# EAGLE design payload (EAGLE 9.6.2)
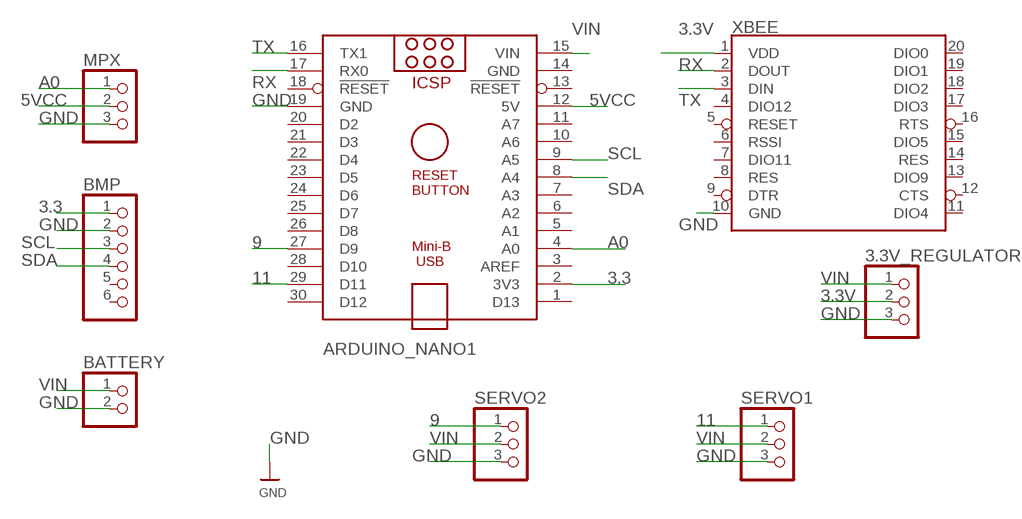
[diagram p0: schematic, sheet 1]

## Parts
3.3V_REGULATOR  PINHD-1X3  [1X03]
ARDUINO_NANO1  ARDUINO_NANO  [ARDUINO_NANO]
BATTERY  PINHD-1X2  [1X02]
BMP  PINHD-1X6  [1X06]
MPX  PINHD-1X3  [1X03]
SERVO1  PINHD-1X3  [1X03]
SERVO2  PINHD-1X3  [1X03]
XBEE  XBEE  [XBEE]

## Nets
3.3: ARDUINO_NANO1.2(3V3) BMP.1
3.3V: 3.3V_REGULATOR.2 XBEE.1(VDD)
5VCC: ARDUINO_NANO1.12(5V) MPX.2
9: ARDUINO_NANO1.27(D9) SERVO2.1
11: ARDUINO_NANO1.29(D11) SERVO1.1
A0: ARDUINO_NANO1.4(A0) MPX.1
GND: 3.3V_REGULATOR.3 ARDUINO_NANO1.19(GND) BATTERY.2 BMP.2 MPX.3 SERVO1.3 SERVO2.3 XBEE.10(GND)
RX: ARDUINO_NANO1.17(RX0) XBEE.2(DOUT)
SCL: ARDUINO_NANO1.9(A5) BMP.3
SDA: ARDUINO_NANO1.8(A4) BMP.4
TX: ARDUINO_NANO1.16(TX1) XBEE.3(DIN)
VIN: 3.3V_REGULATOR.1 ARDUINO_NANO1.15(VIN) BATTERY.1 SERVO1.2 SERVO2.2
Unconnected: ARDUINO_NANO1.1(D13) ARDUINO_NANO1.3(AREF) ARDUINO_NANO1.5(A1) ARDUINO_NANO1.6(A2) ARDUINO_NANO1.7(A3) ARDUINO_NANO1.10(A6) ARDUINO_NANO1.11(A7) ARDUINO_NANO1.13(!RESET) ARDUINO_NANO1.18(!RESET) ARDUINO_NANO1.20(D2) ARDUINO_NANO1.21(D3) ARDUINO_NANO1.22(D4) ARDUINO_NANO1.23(D5) ARDUINO_NANO1.24(D6) ARDUINO_NANO1.25(D7) ARDUINO_NANO1.26(D8) ARDUINO_NANO1.28(D10) ARDUINO_NANO1.30(D12) BMP.5 BMP.6 XBEE.4(DIO12) XBEE.5(RESET) XBEE.6(RSSI) XBEE.7(DIO11) XBEE.8(RES) XBEE.9(DTR) XBEE.11(DIO4) XBEE.12(CTS) XBEE.13(DIO9) XBEE.14(RES) XBEE.15(DIO5) XBEE.16(RTS) XBEE.17(DIO3) XBEE.18(DIO2) XBEE.19(DIO1) XBEE.20(DIO0)

## Power pins joined to a net without a drawn wire
GND: ARDUINO_NANO1.14(GND)

## Library data of the parts
3.3V_REGULATOR MPX SERVO1 SERVO2 = Connector:PINHD-1X3: PIN HEADER; CATEGORY: CONNECTOR; SUB-CATEGORY: PIN-HEADER
ARDUINO_NANO1 = ArduinoNanoV30:ARDUINO_NANO: Arduino Nano V3.0 Overview: The Arduino Nano is a small, complete, and breadboard-friendly board based on the ATmega328 (Arduino Nano 3.x) or ATmega168 (Arduino Nano 2.x). It has more or less the same functionality of the Arduino Duemilanove, but in a different package. It lacks only a DC power jack, and works with a Mini-B USB cable instead of a standard one. The Nano was designed and is being produced by Gravitech. Specifications: Microcontroller Atmel ATmega168 or ATmega328 Operating Voltage (logic level) 5 V Input Voltage (recommended) 7-12 V Input Voltage (limits) 6-20 V Digital I/O Pins 14 (of which 6 provide PWM output) Analog Input Pins 8 DC Current per I/O Pin 40 mA Flash Memory 16 KB (ATmega168) or 32 KB (ATmega328) of which 2 KB used by bootloader SRAM 1 KB (ATmega168) or 2 KB (ATmega328) EEPROM 512 bytes (ATmega168) or 1 KB (ATmega328) Clock Speed 16 MHz Dimensions 0.73" x 1.70" Length 45 mm Width 18 mm Weigth 5 g Power: The Arduino Nano can be powered via the Mini-B USB connection, 6-20V unregulated external power supply (pin 30), or 5V regulated external power supply (pin 27). The power source is automatically selected to the highest voltage source. Memory: The ATmega168 has 16 KB of flash memory for storing code (of which 2 KB is used for the bootloader); the ATmega328 has 32 KB, (also with 2 KB used for the bootloader). The ATmega168 has 1 KB of SRAM and 512 bytes of EEPROM (which can be read and written with the EEPROM library); the ATmega328 has 2 KB of SRAM and 1 KB of EEPROM. Input and Output: Each of the 14 digital pins on the Nano can be used as an input or output, using pinMode(), digitalWrite(), and digitalRead() functions. They operate at 5 volts. Each pin can provide or receive a maximum of 40 mA and has an internal pull-up resistor (disconnected by default) of 20-50 kOhms. In addition, some pins have specialized functions. Visit Arduino - ArduinoBoardNano <https://www.arduino.cc/en/Main/ArduinoBoardNano>
BATTERY = Connector:PINHD-1X2: PIN HEADER; CATEGORY: CONNECTOR; SUB-CATEGORY: PIN-HEADER
BMP = Connector:PINHD-1X6: PIN HEADER; CATEGORY: CONNECTOR; SUB-CATEGORY: PIN-HEADER
XBEE = SparkFun-RF:XBEE: Digi XBee and XBee Pro XBees are tiny blue chips that can communicate wirelessly with each other. They can do simple things, like replacing a couple of wires in serial communication, which is nice when you want to make a remote for your paintball vehicle. SparkFun Products SparkFun XBee Buying Guide <https://www.sparkfun.com/pages/xbee_guide> SparkFun XBee Explorer USB <https://www.sparkfun.com/products/11812> (WRL-11812) Breakout Board for XBee Module <https://www.sparkfun.com/products/8276> (WRL-8276) SparkFun XBee Explorer Regulated <https://www.sparkfun.com/products/11373> (WRL-11373) SparkFun XBee Explorer Dongle <https://www.sparkfun.com/products/11697> (WRL-11697) SparkFun XBee Shield <https://www.sparkfun.com/products/12847> (WRL-12847) SparkFun XBee Explorer Serial <https://www.sparkfun.com/products/13225> (WRL-13225)

## Board
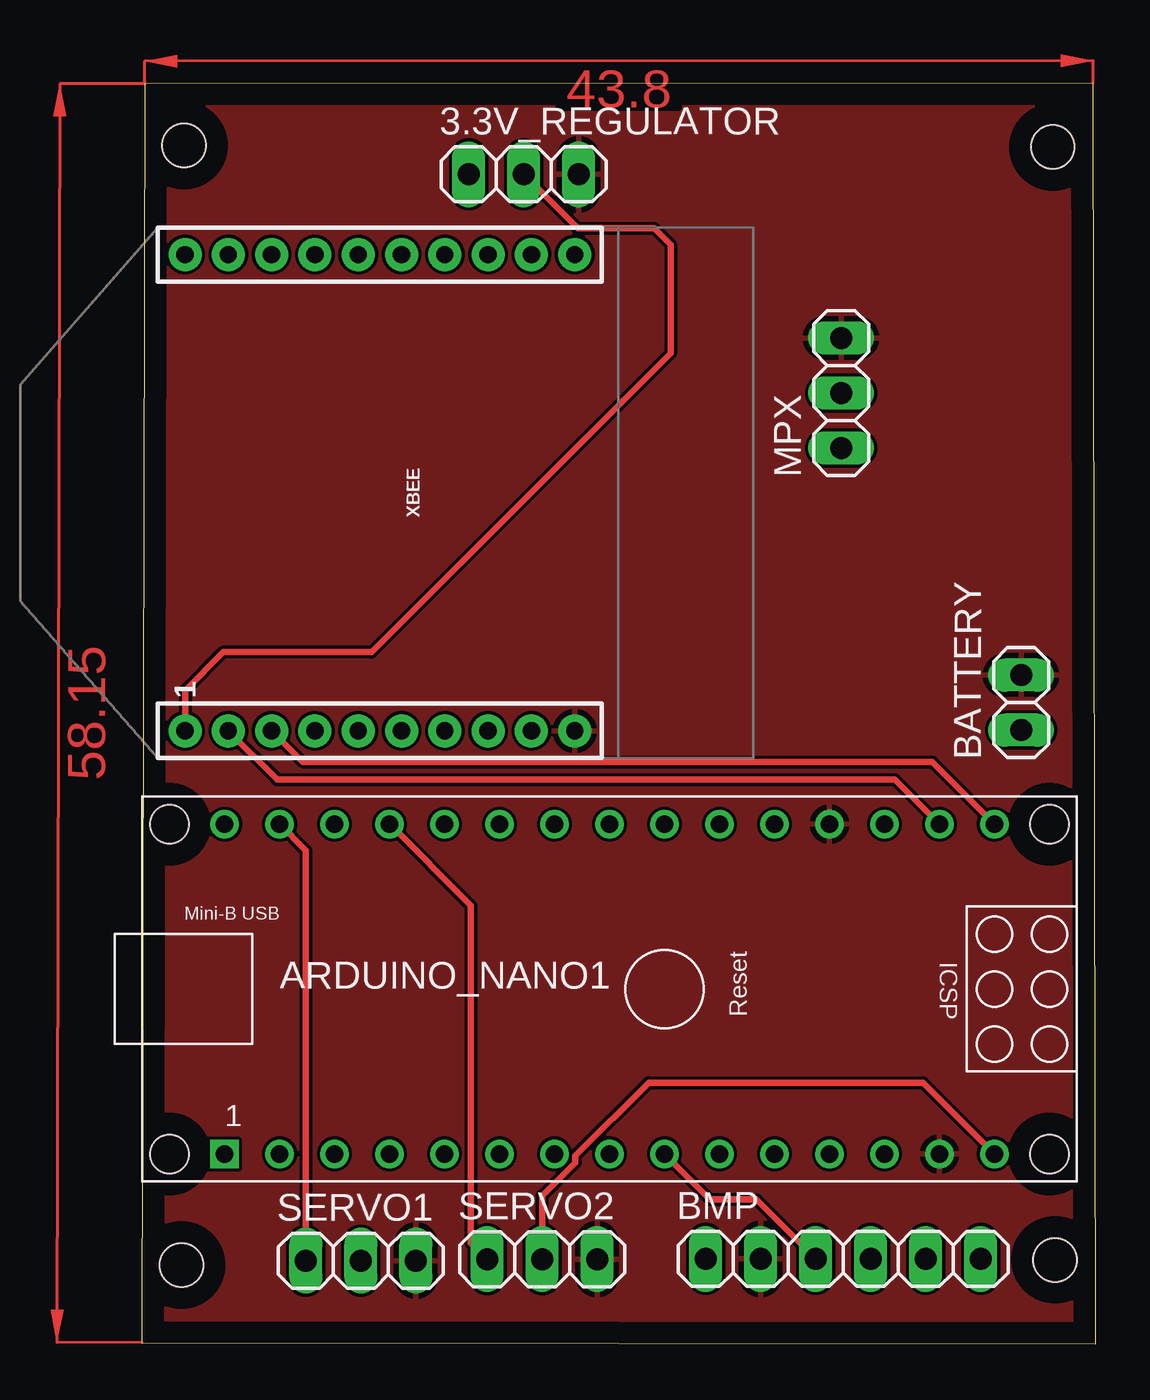
[diagram p1: board, top side]
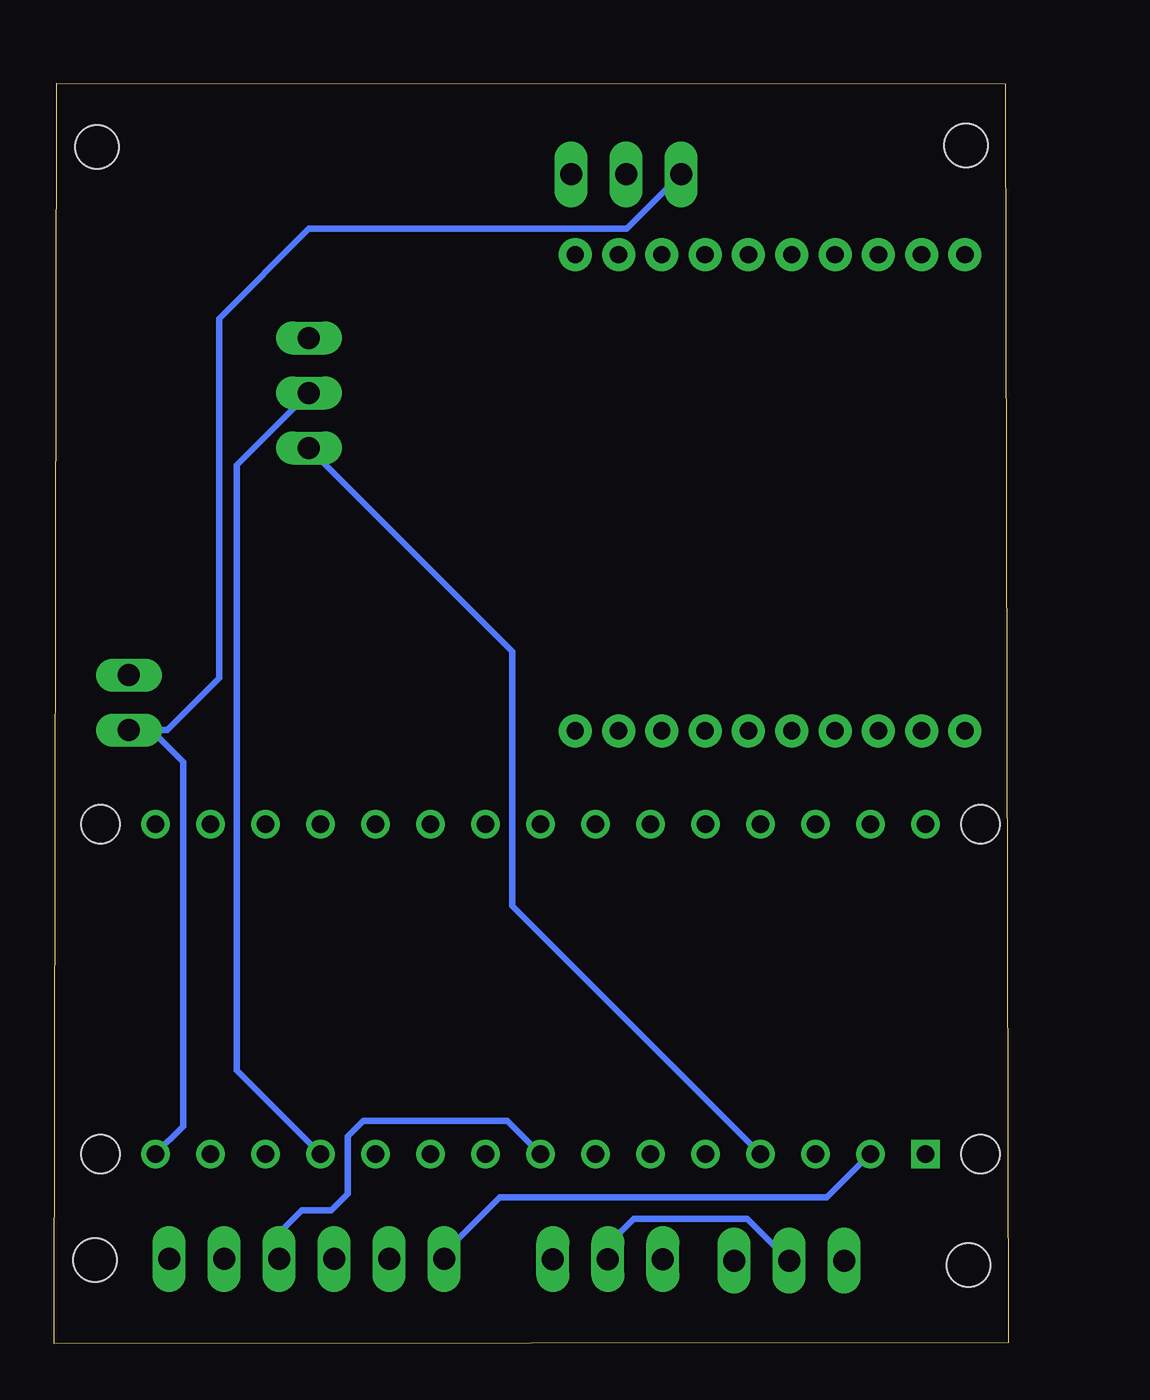
[diagram p2: board, bottom side, seen from below]

Size 44.06 x 58.23 mm. Coordinates in mm from the lower left corner, seen from the top.
Outline: 0,0.05 44.06,0 43.93,58.23 0.14,58.2 0,0.05
Copper layers (1*16): Top 0.035mm / dielectric 1.5mm / Bottom 0.035mm
Design rules "default": minimum track width 6mil, minimum drill 0.35mm, track to track 6mil, track to pad 6mil, pad to pad 6mil, via to via 6mil, smd to smd 6mil, copper to edge 40mil, drill to drill 6mil, minimum pad ring 10mil, minimum via ring 8mil, stop-mask expansion 4mil, vias tented up to drill 0mil, thermal gap 10mil
Holes 2 mm at 1.83,3.63 42.08,55.28 42.18,3.87 1.96,55.36

### Footprints (pad centres in the part's own frame; a part is rotated, then mirrored left to right if it is on the bottom)
1X03 = drill 1.016 long: 1 -2.54,0; 2 0,0; 3 2.54,0
ARDUINO_NANO = drill 0.8 square: 1 -20.32,-7.62 | drill 0.8: 2 -17.78,-7.62; 3 -15.24,-7.62; 4 -12.7,-7.62; 5 -10.16,-7.62; 6 -7.62,-7.62; 7 -5.08,-7.62; 8 -2.54,-7.62; 9 0,-7.62; 10 2.54,-7.62; 11 5.08,-7.62; 12 7.62,-7.62; 13 10.16,-7.62; 14 12.7,-7.62; 15 15.24,-7.62; 16 15.24,7.62; 17 12.7,7.62; 18 10.16,7.62; 19 7.62,7.62; 20 5.08,7.62; 21 2.54,7.62; 22 0,7.62; 23 -2.54,7.62; 24 -5.08,7.62; 25 -7.62,7.62; 26 -10.16,7.62; 27 -12.7,7.62; 28 -15.24,7.62; 29 -17.78,7.62; 30 -20.32,7.62 | hole 1.778: -22.86,-7.62; -22.86,7.62; 17.78,7.62; 17.78,-7.62
1X02 = drill 1.016 long: 1 -1.27,0; 2 1.27,0
1X06 = drill 1.016 long: 1 -6.35,0; 2 -3.81,0; 3 -1.27,0; 4 1.27,0; 5 3.81,0; 6 6.35,0
XBEE = drill 0.8 pad 1.524: 1 -11,20; 2 -11,18; 3 -11,16; 4 -11,14; 5 -11,12; 6 -11,10; 7 -11,8; 8 -11,6; 9 -11,4; 10 -11,2; 11 11,2; 12 11,4; 13 11,6; 14 11,8; 15 11,10; 16 11,12; 17 11,14; 18 11,16; 19 11,18; 20 11,20

### Placement (x,y rotation side)
3.3V_REGULATOR  17.64,54.03 0 top
ARDUINO_NANO1  24.14,16.38 0 top
BATTERY  40.61,29.62 90 top
BMP  32.4,3.91 0 top
MPX  32.3,43.93 90 top
SERVO1  10.12,3.84 0 top
SERVO2  18.49,3.9 0 top
XBEE  22,39.32 90 top

### Tracks (layer width: path | path; a pad name or v marks a point on that pad's centre or on a via)
3.3
  Bottom 0.152: 26.05,4.59 BMP.1
  Bottom 0.305: ARDUINO_NANO1.2 8.37,6.76 23.48,6.76 26.05,4.19 BMP.1
3.3V
  Top 0.305: 3.3V_REGULATOR.2 20.13,51.54 23.66,51.54 24.42,50.77 24.42,45.76 10.62,31.95 3.76,31.95 2,30.19 XBEE.1
5VCC
  Bottom 0.152: 32.68,44.32 MPX.2 32.18,43.81 32.18,43.79
  Bottom 0.305: MPX.2 35.64,40.59 35.64,12.64 ARDUINO_NANO1.12
9
  Top 0.305: ARDUINO_NANO1.27 15.2,20.24 15.2,4.65 SERVO2.1
11
  Top 0.305: ARDUINO_NANO1.29 7.58,22.78 SERVO1.1
A0
  Bottom 0.305: MPX.1 22.9,31.99 22.9,21.21 22.9,20.22 ARDUINO_NANO1.4
GND
  pour Top: -1.26,62.01 -1.26,-1.4 47,-1.4 47,62.01
RX
  Top 0.305: XBEE.2 6.25,26.06 34.79,26.06 ARDUINO_NANO1.17
SCL
  Top 0.305: ARDUINO_NANO1.9 26.24,6.67 28.37,6.67 BMP.3
SDA
  Top 0.152: BMP.4 33.67,2.64
  Bottom 0.305: ARDUINO_NANO1.8 23.13,10.29 29.79,10.29 30.51,9.58 30.51,6.92 31.25,6.17 32.63,6.17 33.67,5.13 BMP.4
TX
  Top 0.305: XBEE.3 7.43,26.89 36.5,26.89 ARDUINO_NANO1.16
VIN
  Top 0.305: ARDUINO_NANO1.15 36.09,12.05 23.41,12.05 20.02,8.67 20.02,8.37 18.49,6.84 SERVO2.2
  Bottom 0.152: BATTERY.1 40.61,28.18 40.61,27.72
  Bottom 0.305: BATTERY.1 38.85,28.35 36.45,30.75 36.45,47.37 32.31,51.51 17.61,51.51 3.3V_REGULATOR.1 | ARDUINO_NANO1.15 38.1,10.05 38.1,26.89 39.4,28.18 40.61,28.18 | SERVO1.2 12.05,5.77 17.3,5.77 18.49,4.57 SERVO2.2
(copper drawn outside any net)
  shapes: Top area x2